# EAGLE design BLT_Preliminary_Avionics_Schematic_Brandon_update_August_8_2021 (EAGLE 9.6.2)
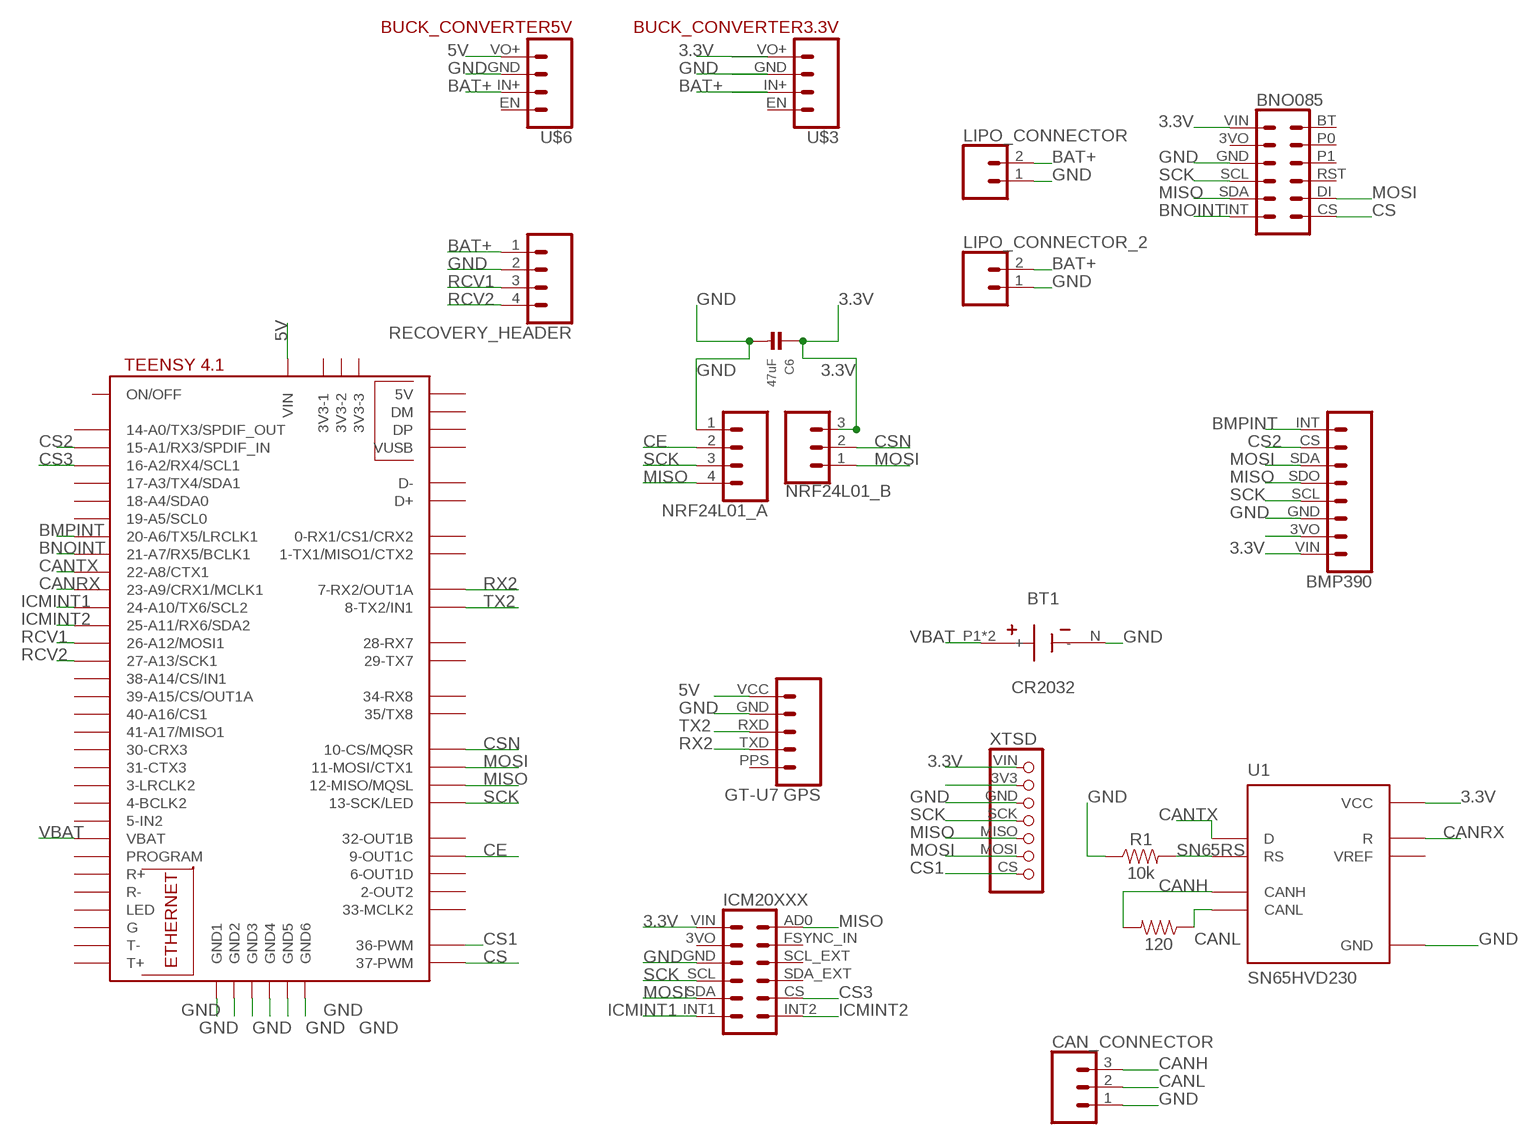
[diagram p0: schematic, sheet 1]

## Parts
120  RESISTOR1206  [1206]
BT1  CR2032  COIN-CELL-THM-3P-3003-CR2032  [BAT_3003]
C6  47uF  CAP_CERAMIC0805  [0805]
CAN_CONNECTOR  CONN_03  [1X03]
LIPO_CONNECTOR  CONN_02PTH4  [1X02_XTRA_BIG]
LIPO_CONNECTOR_2  CONN_02  [1X02]
NRF24L01_A  CONN_04  [1X04]
NRF24L01_B  CONN_03  [1X03]
R1  10k  10KOHM-0603-1/10W-1%  [0603]
RECOVERY_HEADER  CONN_04  [1X04]
U1  SN65HVD230  [SOIC127P599X175-8N]
U$1  TEENSY41  [TEENSY41]
U$2  BMP390  [MICROBUILDER_1X08_ROUND]
U$3  BUCK_CONVERTER3.3V  [1X04]
U$4  GT-U7_GPS  [1X05]
U$5  XTSDXTSD_PINS  [1X07]
U$6  BUCK_CONVERTER5V  [1X04]
U$7  BNO085  [MICROBUILDER_1X06_ROUND_70]
U$8  ICM20XXX  [1X06]

## Nets
3.3V: C6.1 NRF24L01_B.3 U1.3(VCC) U$2.VIN U$3.VO+ U$5.VIN U$7.VIN U$8.VIN(VCC)
5V: U$1.VIN U$4.VCC U$6.VO+
BAT+: LIPO_CONNECTOR.2 LIPO_CONNECTOR_2.2 RECOVERY_HEADER.1 U$3.IN+ U$6.IN+
BMPINT: U$1.20-A6/TX5/LRCLK1 U$2.INT
BNOINT: U$1.21-A7/RX5/BCLK1 U$7.INT
CANH: 120.2 CAN_CONNECTOR.3 U1.7(CANH)
CANL: 120.1 CAN_CONNECTOR.2 U1.6(CANL)
CANRX: U1.4(R) U$1.23-A9/CRX1/MCLK1
CANTX: U1.1(D) U$1.22-A8/CTX1
CE: NRF24L01_A.2 U$1.9-OUT1C
CS: U$1.37-PWM U$7.CS
CS1: U$1.36-PWM U$5.CS
CS2: U$1.15-A1/RX3/SPDIF_IN U$2.CS
CS3: U$1.16-A2/RX4/SCL1 U$8.CS
CSN: NRF24L01_B.2 U$1.10-CS\MQSR(10-CS/MQSR)
GND: BT1.N(-) C6.2 CAN_CONNECTOR.1 LIPO_CONNECTOR.1 LIPO_CONNECTOR_2.1 NRF24L01_A.1 R1.1 RECOVERY_HEADER.2 U1.2(GND) U$1.GND1 U$1.GND2 U$1.GND3 U$1.GND4 U$1.GND5 U$1.GND6 U$2.GND U$3.GND U$4.GND U$5.GND U$6.GND U$7.GND U$8.GND
ICMINT1: U$1.24-A10/TX6/SCL2 U$8.INT1
ICMINT2: U$1.25-A11/RX6/SDA2 U$8.INT2
MISO: NRF24L01_A.4 U$1.12-MISO/MQSL U$2.SDO U$5.MISO U$7.SDA U$8.AD0
MOSI: NRF24L01_B.1 U$1.11-MOSI/CTX1 U$2.SDA U$5.MOSI U$7.DI U$8.SDA
N$9: U$5.3V3
N$13: U$2.3VO
RCV1: RECOVERY_HEADER.3 U$1.26-A12/MOSI1
RCV2: RECOVERY_HEADER.4 U$1.27-A13/SCK1
RX2: U$1.7-RX2/OUT1A U$4.TXD
SCK: NRF24L01_A.3 U$1.13-SCK/LED U$2.SCL U$5.SCK U$7.SCL U$8.SCL
SN65RS: R1.2 U1.8(RS)
TX2: U$1.8-TX2/IN1 U$4.RXD
VBAT: BT1.P1(+) BT1.P2(+) U$1.VBAT
Unconnected: U1.5(VREF) U$1.0-RX1/CS1/CRX2 U$1.1-TX1/MISO1/CTX2 U$1.2-OUT2 U$1.3-LRCLK2 U$1.3V3-1 U$1.3V3-2 U$1.3V3-3 U$1.4-BCLK2 U$1.5-IN2 U$1.6-OUT1D U$1.14-A0/TX3/SPDIF_OUT U$1.17-A3/TX4/SDA1 U$1.18-A4/SDA0 U$1.19-A5/SCL0 U$1.28-RX7 U$1.29-TX7 U$1.30-CRX3 U$1.31-CTX3 U$1.32-OUT1B U$1.33-MCLK2 U$1.34-RX8 U$1.35-TX8(35/TX8) U$1.38-A14/CS/IN1 U$1.39-A15/CS/OUT1A U$1.40-A16/CS1 U$1.41-A17/MISO1 U$1.+5V(5V) U$1.D+ U$1.D- U$1.DM U$1.DP U$1.G U$1.LED U$1.ON/OFF U$1.PROGRAM U$1.R+ U$1.R- U$1.T+ U$1.T- U$1.VUSB U$3.EN U$4.PPS U$6.EN U$7.3VO U$7.BT U$7.P0 U$7.P1 U$7.RST U$8.3VO U$8.FSYNC_IN U$8.SCL_EXT U$8.SDA_EXT

## Library data of the parts
120 = SparkFun-Resistors:RESISTOR: Generic Resistor Package
BT1 = Battery_Holder:COIN-CELL-THM-3P?-: Battery Holders - Coin Cell THT - CR2032, LR44, SR44 etc. Datasheet <https://docs.rs-online.com/b397/0900766b813ec0e2.pdf>; CATEGORY: Battery-Holder; CELL_DIAMETER: 20mm; DESCRIPTION: Battery Retainer Coin, 20.0mm 1 Cell PC Pin; MANUFACTURER: Keystone Electronics; MPN: 3003; PART_STATUS: ACTIVE; ROHS_COMPLIANT: COMPLIANT; SERIES: -; SUB_CATEGORY: Holder; TYPE: Coin Cell
C6 = microbuilder:CAP_CERAMIC: Ceramic Capacitors 0402 - 0402 Surface Mount Capacitors 16pF 50V 5% [Digikey: 445-4899-2-ND] 18pF 50V 5% [Digikey: 490-1281-2-ND] 22pF 50V 5% [Digikey: 490-1283-2-ND] 68pF 50V 5% [Digikey: 490-1289-2-ND] 0.1uF 10V 10% [Digikey: 490-1318-2-ND] 1.0uF 6.3V 10% [Digikey: 490-1320-2-ND] 0603 - 0603 Surface Mount Capacitors 16 pF 50V 5% [Digikey: 445-5051-2-ND] 22 pF 50V [Digikey: PCC220ACVTR-ND] 33 pF 50V 5% [Digikey: 490-1415-1-ND] 56pF 50V 5% [Digikey: 490-1421-1-ND] 220pF 50V 5% [Digikey: 445-1285-1-ND] 680 pF 50V 2200 pF 50V 5% C0G [Digikey: 445-1297-1-ND] 5600 pF 100V 5% X7R [Digikey: 478-3711-1-ND] 0.1 µF 25V 10% [Digikey: PCC2277TR-ND] 0.22 µF 16V 10% X7R [Digikey: 445-1318-1-ND] 1.0 µF 25V 10% [Digikey: 445-5146-2-ND] 0603 - RF Specific 3pF 250V +/-0.1pF RF [Digikey: 712-1347-1-ND] 18 pF 250V 5% [Digikey: 478-3505-1-ND or 712-1322-1-ND] 56 pF 250V 5% C0G RF [Digikey: 490-4867-1-ND] 68 pF 250V RF [Digikey: 490-4868-1-ND] 0805 - 0805 Surface Mount Capacitors 220 pF 250V 2% RF Ceramic Capacitor [Digikey: 712-1398-1-ND] 1000 pF 50V 2% NP0 Ceramic Capacitor [Digikey: 478-3760-1-ND] 0.1 µF 25V 10% Ceramic Capacitor [Digikey: PCC1828TR-ND] 1.0 µF 16V 10% Ceramic Capacitor[Digikey: 490-1691-2-ND] 10.0 µF 10V 10% Ceramic Capacitor[Digikey: 709-1228-1-ND] 10.0 uF 16V 10% Ceramic Capacitor [Digikey: 478-5165-2-ND] 47 uF 6.3V 20% Ceramic Capacitor [Digikey: 587-1779-1-ND or 399-5506-1-ND] 1206 - 1206 Surface Mount Capacitors 47uF 10V 20% Ceramic Capacitor [Digikey: 490-5528-1-ND or 399-5508-1-ND or 445-6010-1-ND] 100uF 6.3V -20%, +80% Y5V Ceramic Capacitor (Digikey: 490-4512-1-ND, Mouser: 81-GRM31CF50J107ZE1L)
CAN_CONNECTOR NRF24L01_B = SparkFun-Connectors:CONN_03: Multi connection point. Often used as Generic Header-pin footprint for 0.1 inch spaced/style header connections On any of the 0.1 inch spaced packages, you can populate with these: Break Away Headers - Straight <https://www.sparkfun.com/products/116> (PRT-00116) Break Away Male Headers - Right Angle <https://www.sparkfun.com/products/553> (PRT-00553) Female Headers <https://www.sparkfun.com/products/115> (PRT-00115) Break Away Headers - Machine Pin <https://www.sparkfun.com/products/117> (PRT-00117) Break Away Female Headers - Swiss Machine Pin <https://www.sparkfun.com/products/743> (PRT-00743) Stackable Header - 3 Pin (Female, 0.1") <https://www.sparkfun.com/products/13875> (PRT-13875) For SCREWTERMINALS and SPRING TERMINALS visit here: Screw Terimnals on SparkFun.com <https://www.sparkfun.com/search/results?term=Screw+Terminals> (5mm/3.5mm/2.54mm spacing) This device is also useful as a general connection point to wire up your design to another part of your project. Our various solder wires solder well into these plated through hole pads. Hook-Up Wire - Assortment (Stranded, 22 AWG) <https://www.sparkfun.com/products/11375> (PRT-11375) Hook-Up Wire - Assortment (Solid Core, 22 AWG) <https://www.sparkfun.com/products/11367> (PRT-11367) View the entire wire category on our website here <https://www.sparkfun.com/categories/141> Special notes: Molex polarized connector foot print use with SKU : PRT-08232 with associated crimp pins and housings.
LIPO_CONNECTOR LIPO_CONNECTOR_2 = SparkFun-Connectors:CONN_02: Multi connection point. Often used as Generic Header-pin footprint for 0.1 inch spaced/style header connections On any of the 0.1 inch spaced packages, you can populate with these: Break Away Headers - Straight <https://www.sparkfun.com/products/116> (PRT-00116) Break Away Male Headers - Right Angle <https://www.sparkfun.com/products/553> (PRT-00553) Female Headers <https://www.sparkfun.com/products/115> (PRT-00115) Break Away Headers - Machine Pin <https://www.sparkfun.com/products/117> (PRT-00117) Break Away Female Headers - Swiss Machine Pin <https://www.sparkfun.com/products/743> (PRT-00743) For SCREWTERMINALS and SPRING TERMINALS visit here: Screw Terimnals on SparkFun.com <https://www.sparkfun.com/search/results?term=Screw+Terminals> (5mm/3.5mm/2.54mm spacing) This device is also useful as a general connection point to wire up your design to another part of your project. Our various solder wires solder well into these plated through hole pads. Hook-Up Wire - Assortment (Stranded, 22 AWG) <https://www.sparkfun.com/products/11375> (PRT-11375) Hook-Up Wire - Assortment (Solid Core, 22 AWG) <https://www.sparkfun.com/products/11367> (PRT-11367) View the entire wire category on our website here <https://www.sparkfun.com/categories/141> Special notes: Molex polarized connector foot print use with: PRT-08233 with associated crimp pins and housings. 2.54_SCREWTERM for use with PRT-10571. 3.5mm Screw Terminal footprints for PRT-08084 5mm Screw Terminal footprints for use with PRT-08432
NRF24L01_A RECOVERY_HEADER = SparkFun-Connectors:CONN_04: Multi connection point. Often used as Generic Header-pin footprint for 0.1 inch spaced/style header connections On any of the 0.1 inch spaced packages, you can populate with these: Break Away Headers - Straight <https://www.sparkfun.com/products/116> (PRT-00116) Break Away Male Headers - Right Angle <https://www.sparkfun.com/products/553> (PRT-00553) Female Headers <https://www.sparkfun.com/products/115> (PRT-00115) Break Away Headers - Machine Pin <https://www.sparkfun.com/products/117> (PRT-00117) Break Away Female Headers - Swiss Machine Pin <https://www.sparkfun.com/products/743> (PRT-00743) For SCREWTERMINALS and SPRING TERMINALS visit here: Screw Terimnals on SparkFun.com <https://www.sparkfun.com/search/results?term=Screw+Terminals> (5mm/3.5mm/2.54mm spacing) This device is also useful as a general connection point to wire up your design to another part of your project. Our various solder wires solder well into these plated through hole pads. Hook-Up Wire - Assortment (Stranded, 22 AWG) <https://www.sparkfun.com/products/11375> (PRT-11375) Hook-Up Wire - Assortment (Solid Core, 22 AWG) <https://www.sparkfun.com/products/11367> (PRT-11367) View the entire wire category on our website here <https://www.sparkfun.com/categories/141> Special notes: Molex polarized connector foot print use with SKU : PRT-08231 with associated crimp pins and housings. 1MM SMD Version SKU: PRT-10208; PROD_ID: CONN-09696
R1 = SparkFun-Resistors:10KOHM: 10kΩ resistor A resistor is a passive two-terminal electrical component that implements electrical resistance as a circuit element. Resistors act to reduce current flow, and, at the same time, act to lower voltage levels within circuits. - Wikipedia; PROD_ID: RES-00824
U1 = SN65HVD230:SN65HVD230: the sn65hvd230 sn65hvd231 and sn65hvd232 controller area network (can) transceivers are designed for use with the tex... Check prices <https://pricing.snapeda.com/parts/SN65HVD230/Texas%20Instruments/view-part?ref=eda>; AVAILABILITY: In Stock; DESCRIPTION: 1/1 Transceiver Half CANbus 8-SOIC; MF: Texas Instruments; MP: SN65HVD230; PACKAGE: SOIC-8 Texas Instruments; PRICE: None; PURCHASE-URL: https://pricing.snapeda.com/search/part/SN65HVD230/?ref=eda
U$1 = teensy:TEENSY41
U$2 = BLTFootprints:BMP390
U$3 = BLTFootprints:BUCK_CONVERTER; VOLTAGE: 3.3V
U$4 = BLTFootprints:GT-U7_GPS
U$5 = BLTFootprints:XTSD
U$6 = BLTFootprints:BUCK_CONVERTER; VOLTAGE: 5V
U$7 = BLTFootprints:BNO085
U$8 = BLTFootprints:ICM20XXX

## Board
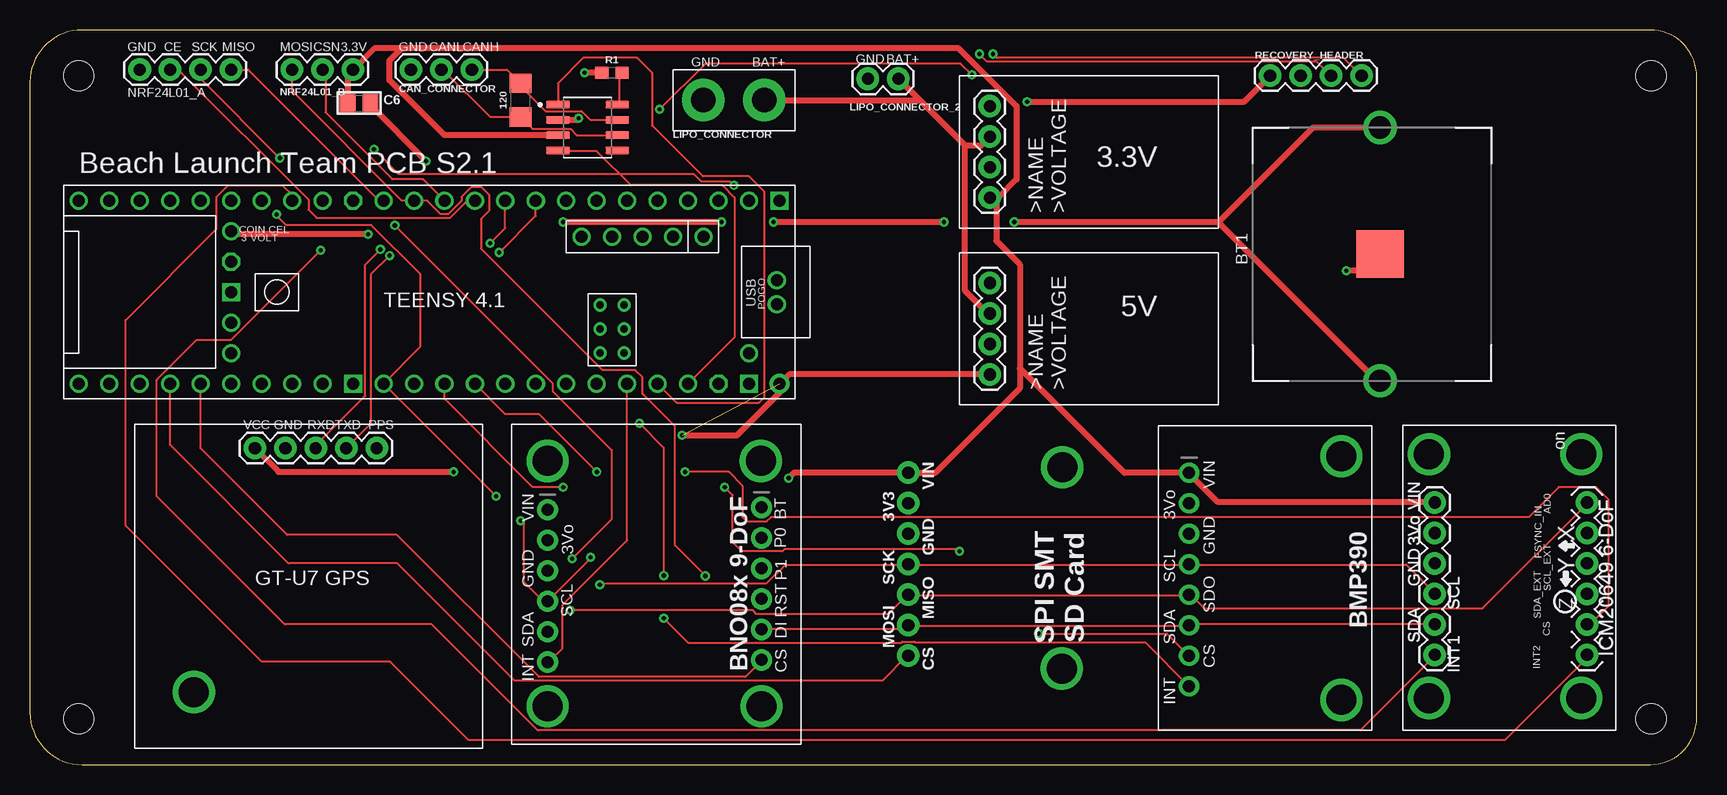
[diagram p1: board, top side]
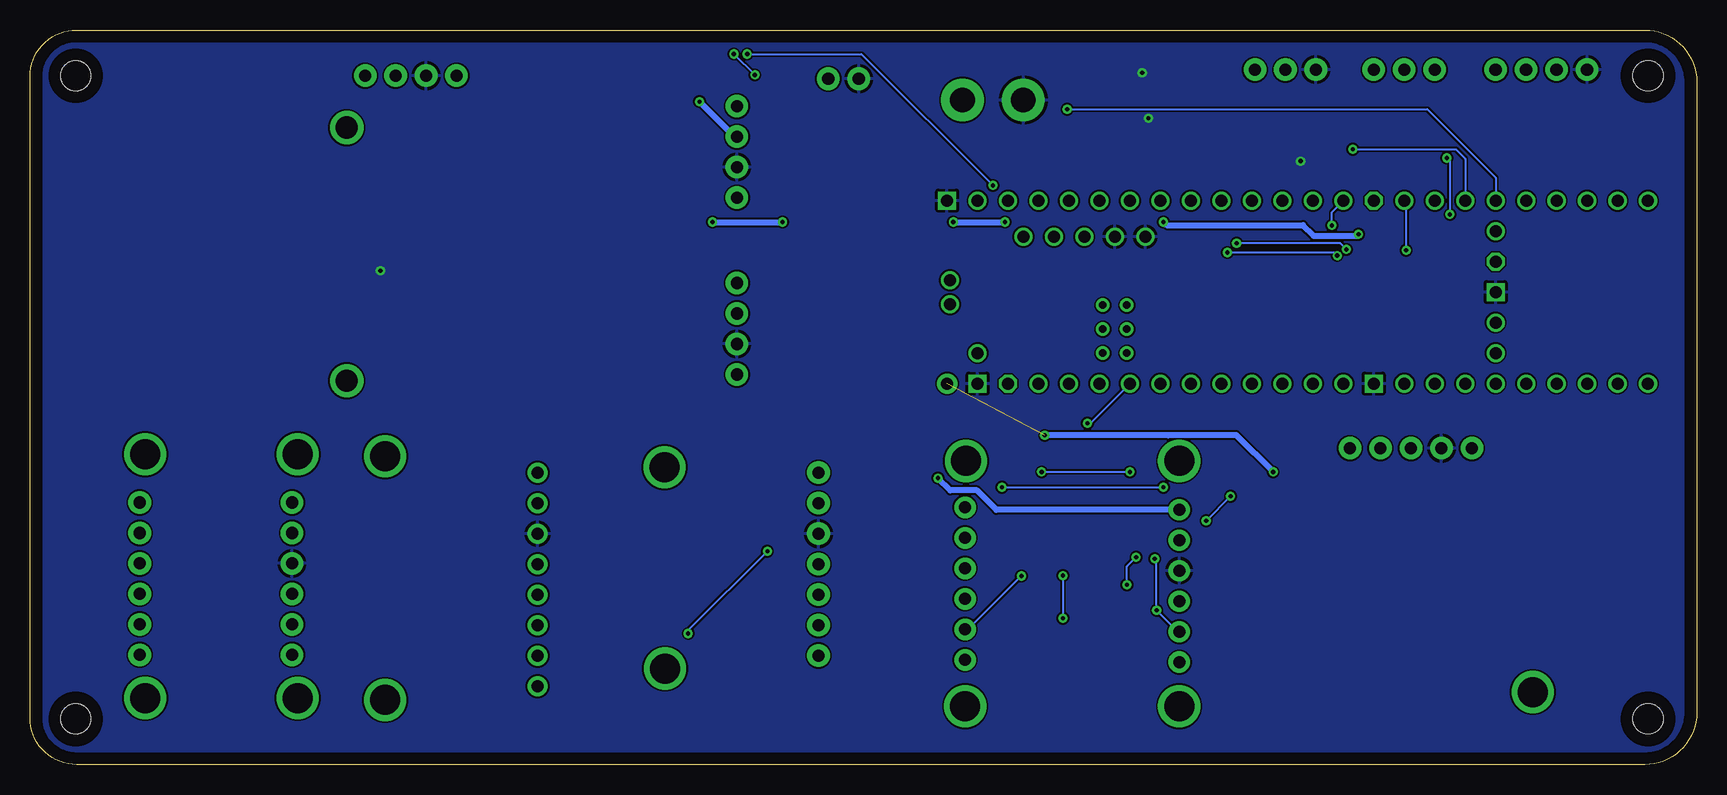
[diagram p2: board, bottom side, seen from below]

Size 138.94 x 61.21 mm. Coordinates in mm from the lower left corner, seen from the top.
Outline: 0,56.88 0,4.34 arc90 4.34,0 135.05,0 arc90 138.94,3.89 138.94,57.32 arc90 135.05,61.21 4.34,61.21 arc90 0,56.88
Copper layers (1*16): Top 0.035mm / dielectric 1.5mm / Bottom 0.035mm
Design rules "default": minimum track width 6mil, minimum drill 0.35mm, track to track 6mil, track to pad 6mil, pad to pad 6mil, via to via 6mil, smd to smd 6mil, copper to edge 40mil, drill to drill 6mil, minimum pad ring 10mil, minimum via ring 8mil, stop-mask expansion 4mil, vias tented up to drill 0mil, thermal gap 10mil
Holes 2.5 mm at 4.06,57.4 4.06,3.81 135.13,57.4 135.13,3.81

### Footprints (pad centres in the part's own frame; a part is rotated, then mirrored left to right if it is on the bottom)
1206 = smd 1.6 x 1.8: 1 -1.4,0; 2 1.4,0
BAT_3003 = smd 3.96 x 3.96: N 10.53,-0.01 | drill 1.85: P1 -0.02,-0.01; P2 21.08,-0.01
0805 = smd 1.3 x 1.5: 1 -0.95,0; 2 0.95,0
1X03 = drill 1.016 pad 1.88: 1 0,0; 2 2.54,0; 3 5.08,0
1X02_XTRA_BIG = drill 2.057 pad 3.556: 1 -2.54,0; 2 2.54,0
1X02 = drill 1.016 pad 1.88: 1 0,0; 2 2.54,0
1X04 = drill 1.016 pad 1.88: 1 0,0; 2 2.54,0; 3 5.08,0; 4 7.62,0
0603 = smd 1.1 x 1: 1 -0.85,0; 2 0.85,0
SOIC127P599X175-8N = smd 1.97 x 0.6: 1 -2.47,1.905; 2 -2.47,0.635; 3 -2.47,-0.635; 4 -2.47,-1.905; 5 2.47,-1.905; 6 2.47,-0.635; 7 2.47,0.635; 8 2.47,1.905
TEENSY41 = drill 1: 0-RX1/CS1/CRX2 -27.94,-7.62; 1-TX1/MISO1/CTX2 -25.4,-7.62; 2-OUT2 -22.86,-7.62; 3-LRCLK2 -20.32,-7.62; 4-BCLK2 -17.78,-7.62; 5-IN2 -15.24,-7.62; 6-OUT1D -12.7,-7.62; 7-RX2/OUT1A -10.16,-7.62; 8-TX2/IN1 -7.62,-7.62; 9-OUT1C -5.08,-7.62; 10-CS\MQSR -2.54,-7.62; 11-MOSI/CTX1 0,-7.62; 12-MISO/MQSL 2.54,-7.62; 13-SCK/LED 2.54,7.62; 14-A0/TX3/SPDIF_OUT 0,7.62; 15-A1/RX3/SPDIF_IN -2.54,7.62; 16-A2/RX4/SCL1 -5.08,7.62; 17-A3/TX4/SDA1 -7.62,7.62; 18-A4/SDA0 -10.16,7.62; 19-A5/SCL0 -12.7,7.62; 20-A6/TX5/LRCLK1 -15.24,7.62; 21-A7/RX5/BCLK1 -17.78,7.62; 22-A8/CTX1 -20.32,7.62; 23-A9/CRX1/MCLK1 -22.86,7.62; 24-A10/TX6/SCL2 7.62,-7.62; 25-A11/RX6/SDA2 10.16,-7.62; 26-A12/MOSI1 12.7,-7.62; 27-A13/SCK1 15.24,-7.62; 28-RX7 17.78,-7.62; 29-TX7 20.32,-7.62; 30-CRX3 22.86,-7.62; 31-CTX3 25.4,-7.62; 32-OUT1B 27.94,-7.62; 33-MCLK2 27.94,7.62; 34-RX8 25.4,7.62; 35-TX8 22.86,7.62; 36-PWM 20.32,7.62; 37-PWM 17.78,7.62; 38-A14/CS/IN1 15.24,7.62; 39-A15/CS/OUT1A 12.7,7.62; 40-A16/CS1 10.16,7.62; 41-A17/MISO1 7.62,7.62; +5V -24.13,-4.62; D+ -30.25,-1; D- -30.25,1; DM -21.59,-4.62; DP -19.05,-4.62; GND4 -16.51,-4.62; GND5 -13.97,-4.62; ON/OFF 15.24,5.08; PROGRAM 15.24,2.54; VBAT 15.24,-5.08; VUSB -27.94,5.08 | drill 1 octagon: 3V3-1 5.08,-7.62; 3V3-2 15.24,-2.54; 3V3-3 -25.4,7.62 | drill 0.6: G -15.51,3.08; LED -17.51,3.08; R+ -17.51,5.08; R- -15.51,5.08; T+ -15.51,1.08; T- -17.51,1.08 | drill 1 square: GND1 -30.48,-7.62; GND2 15.24,0; GND3 5.08,7.62; GND6 -27.94,7.62 | drill 1 pad 1.676: VIN -30.48,7.62
MICROBUILDER_1X08_ROUND = drill 1 pad 1.676: 3VO -6.223,0; CS 6.477,0; GND -3.683,0; INT 9.017,0; SCL -1.143,0; SDA 3.937,0; SDO 1.397,0; VIN -8.763,0 | drill 2.5 pad 3.2: P$1 -10.16,12.7; P$2 10.16,12.7
1X04' = drill 1.016 pad 1.88: EN 7.62,0; GND 2.54,0; IN+ 5.08,0; VO+ 0,0
1X05 = drill 1.016 pad 1.88: GND 2.54,0; PPS 10.16,0; RXD 5.08,0; TXD 7.62,0; VCC 0,0 | drill 2.5 pad 3.2: P$1 -5.08,-20.32
1X07 = drill 1.016 pad 1.88: 3V3 4.128,0.794; CS 16.828,0.794; GND 6.668,0.794; MISO 11.748,0.794; MOSI 14.287,0.794; SCK 9.207,0.794; VIN 1.587,0.794 | drill 2.5 pad 3.2: P$1 1.124,13.626; P$4 17.907,13.589
MICROBUILDER_1X06_ROUND_70 = drill 1 pad 1.778: 3VO 9.652,-5.905; BT 6.921,11.938; CS 19.622,11.938; DI 17.081,11.938; GND 12.192,-5.905; INT 19.812,-5.905; P0 9.461,11.938; P1 12.002,11.938; RST 14.541,11.938; SCL 14.732,-5.905; SDA 17.272,-5.905; VIN 7.112,-5.905 | drill 2.5 pad 3.2: P$1 23.495,11.938; P$2 3.048,11.874; P$3 3.048,-5.905; P$4 23.495,-5.905
1X06 = drill 1.016 pad 1.88: 3VO 2.54,0; AD0 0,12.7; CS 10.16,12.7; FSYNC_IN 2.54,12.7; GND 5.08,0; INT1 12.7,0; INT2 12.7,12.7; SCL 7.62,0; SCL_EXT 5.08,12.7; SDA 10.16,0; SDA_EXT 7.62,12.7; VIN 0,0 | drill 2.5 pad 3.2: P$1 -4.019,12.229; P$2 16.301,12.229; P$3 16.301,-0.471; P$4 -4.019,-0.471

### Placement (x,y rotation side)
120  40.89,55.37 90 top
BT1  112.52,32 90 top
C6  27.43,55.12 0 top
CAN_CONNECTOR  31.75,57.91 0 top
LIPO_CONNECTOR  58.67,55.37 0 top
LIPO_CONNECTOR_2  69.85,57.15 0 top
NRF24L01_A  9.14,57.91 0 top
NRF24L01_B  21.84,57.91 0 top
R1  48.51,57.66 0 top
RECOVERY_HEADER  103.38,57.4 0 top
U1  46.48,53.09 0 top
U$1  32,39.37 180 top
U$2  96.62,15.54 270 top
U$3  BUCK_CONVERTER3.3V  [1X04']  80.01,47.24 90 top
U$4  18.75,26.37 0 top
U$5  72.42,25.91 270 top
U$6  BUCK_CONVERTER5V  [1X04']  80.01,32.51 90 top
U$7  49.05,28.35 270 top
U$8  117.09,21.84 270 top

### Tracks (layer width: path | path; a pad name or v marks a point on that pad's centre or on a via)
3.3V  (via drill 0.35)
  Top 0.152: 117.09,21.88 U$8.VIN
  Top 0.508: 82.52,33.02 82.52,41.69 80.55,43.66 80.55,46.7 U$3.VO+ 80.72,47.24 82.24,48.77 82.24,54.86 77.42,59.69 30.99,59.69 | 82.52,33.02 82.52,31.34 75.49,24.32 U$5.VIN 63.69,24.32 v63.25,23.88 | 30.99,59.69 28.7,59.69 NRF24L01_B.3 26.48,57.47 C6.1 | 117.09,21.88 99.03,21.88 96.62,24.28 U$2.VIN 91.23,24.31 82.52,33.02 | U1.3 34.54,52.45 29.97,57.02 29.97,58.67 30.99,59.69
  Bottom 0.508: U$7.VIN 58.38,21.23 59.99,22.85 62.22,22.85 v63.25,23.88
5V  (via drill 0.35)  (1 unrouted)
  Top 0.508: U$6.VO+ 63.31,32.51 62.55,31.75 62.55,31.05 58.93,27.43 v54.36,27.43 | U$4.VCC 20.73,24.38 v35.31,24.38
  Bottom 0.508: v54.36,27.43 44.07,27.43 44.04,27.46 38.38,27.46 v35.31,24.38
BAT+  (via drill 0.35)
  Top 0.508: 77.95,51.56 77.95,39.46 79.82,37.59 U$6.IN+ | LIPO_CONNECTOR.2 74.17,55.37 | U$3.IN+ 79.25,51.56 77.95,51.56 | 77.95,51.56 77.95,51.59 74.17,55.37 | LIPO_CONNECTOR_2.2 74.17,55.37 | RECOVERY_HEADER.1 101.22,55.24 v83.12,55.24
  Bottom 0.152: 80.1,52.23 U$3.IN+
  Bottom 0.508: 80.1,52.23 v83.12,55.24
BMPINT  (via drill 0.35)
  Top 0.152: v50.8,28.45 52.83,26.42 v52.83,15.75 | v52.83,12.19 54.86,10.16 60.51,10.16 60.52,10.15 72.62,10.15 72.72,10.25 73.69,10.25 73.77,10.17 92.98,10.17 U$2.INT
  Bottom 0.152: U$1.20-A6/TX5/LRCLK1 50.55,28.45 v50.8,28.45 | v52.83,15.75 v52.83,12.19
BNOINT
  Top 0.152: U$1.21-A7/RX5/BCLK1 49.78,18.7 44.39,13.3 44.39,9.68 43.28,8.57 U$7.INT
CANH
  Top 0.152: CAN_CONNECTOR.3 39.75,57.91 120.2 40.89,56.54 42.98,54.45 45.97,54.45 46.71,53.72 U1.7
CANL
  Top 0.152: CAN_CONNECTOR.2 34.42,57.91 38.36,53.97 120.1 41.89,52.98 45.05,52.98 45.58,52.45 U1.6
CANRX
  Top 0.152: U1.4 44.07,51.12 47.24,51.12 50.1,48.26 57.72,48.26 58.74,47.24 58.74,35.62 U$1.23-A9/CRX1/MCLK1
CANTX
  Top 0.152: U1.1 44.01,56.78 46.16,58.93 50.55,58.93 51.84,57.63 51.84,53.27 56.09,49.02 59.94,49.02 61.21,47.75 61.21,30.61 60.77,30.16 53.91,30.16 U$1.22-A8/CTX1
CE
  Top 0.152: U$1.9-OUT1C 36.45,46.99 35.02,45.56 23.88,45.56 23.21,46.23 23.21,47.05 12.35,57.91 NRF24L01_A.2
CS
  Top 0.152: U$1.37-PWM 14.22,26.35 21.43,19.15 30.57,19.15 42.42,7.3 59.63,7.3 60.9,8.57 U$7.CS
CS1
  Top 0.152: U$1.36-PWM 11.68,26.64 21.57,16.75 21.59,16.76 30.61,16.76 40.39,6.98 71.06,6.98 73.12,9.05 U$5.CS
CS2  (via drill 0.35)
  Top 0.152: v57.91,23.11 58.58,22.45 58.58,18.54 59.35,17.77 62.72,17.77 62.89,17.94 77.31,17.94 v77.47,17.78 | U$1.15-A1/RX3/SPDIF_IN 34.54,30.48 41.91,23.11 v44.45,23.11 | v84.07,10.92 94.77,10.92 U$2.CS
  Bottom 0.152: v57.91,23.11 v44.45,23.11 | v77.47,17.78 84.07,11.18 v84.07,10.92
CS3  (via drill 0.35)
  Top 0.152: v54.61,24.38 58.26,24.38 59.39,23.26 59.39,20.62 59.76,20.26 61.4,20.26 61.75,20.61 124.93,20.61 127.43,23.11 130.56,23.11 131.57,22.1 131.57,13.21 130.05,11.68 U$8.CS | v47.24,24.38 42.42,29.21 39.62,29.21 U$1.16-A2/RX4/SCL1
  Bottom 0.152: v54.61,24.38 v47.24,24.38
CSN
  Top 0.152: NRF24L01_B.2 24.64,57.66 24.64,54.36 30.23,48.77 32.77,48.77 U$1.10-CS\MQSR
GND  (via drill 0.35)
  Top 0.508: BT1.N 111.15,41.15 v109.73,41.15 | R1.1 v46.23,57.66 | v45.72,53.85 45.59,53.72 U1.2 | C6.2 28.38,54.93 v33.02,50.29
  pour Bottom: 138.68,5.32 138.68,56.71 arc90 134.65,60.75 5.21,61.05 arc90 0.51,56.36 0.51,4.55 arc90 4.81,0.25 133.62,0.25 arc90
ICMINT1  (via drill 0.35)
  Top 0.152: v24.22,42.86 16.76,35.4 13.91,35.4 10.57,32.07 10.57,22.35 21.24,11.68 33.5,11.68 42.32,2.86 110.9,2.86 117.09,9.05 U$8.INT1
  Bottom 0.152: U$1.24-A10/TX6/SCL2 24.22,46.83 v24.22,42.86
ICMINT2
  Top 0.152: U$1.25-A11/RX6/SDA2 21.84,47.47 21.08,48.23 16.48,48.23 15.53,47.28 15.53,44.6 7.97,37.04 7.97,19.91 19.3,8.57 30.04,8.57 36.58,2.03 122.94,2.03 129.79,8.89 U$8.INT2
MISO  (via drill 0.35)
  Top 0.152: U$1.12-MISO/MQSL 29.11,46.99 18.19,57.91 NRF24L01_A.4 | v45.02,12.86 60.26,12.86 60.58,12.54 71.53,12.54 73.12,14.13 U$5.MISO 73.28,14.13 96.61,14.13 U$2.SDO 96.77,14.13 97.88,13.02 121.06,13.02 129.79,21.75 U$8.AD0 | v30.42,44.93 43.59,31.75 43.59,31.08 48.48,26.19 48.48,20.45 v45.18,17.15
  Bottom 0.152: U$7.SDA 43.28,11.11 v45.02,12.86 45.02,16.99 v45.18,17.15 | U$1.12-MISO/MQSL 30.42,46.04 v30.42,44.93
MOSI  (via drill 0.35)
  Top 0.152: U$7.DI 61.05,11.27 72.8,11.27 73.12,11.59 U$5.MOSI 73.28,11.59 96.61,11.59 U$2.SDA 96.77,11.75 117.09,11.75 U$8.SDA | v56.29,15.72 53.75,18.26 53.75,28.19 51.05,30.89 51.05,32.26 50.45,32.86 47.72,32.86 37.59,42.99 37.59,45.47 38.26,46.13 38.26,47.5 37.66,48.1 36.77,48.1 35.97,47.31 35.97,46.99 34.86,45.88 34.23,45.88 33.12,46.99 U$1.11-MOSI/CTX1 30.99,46.99 21.84,56.13 NRF24L01_B.1
  Bottom 0.152: v56.29,15.72 60.9,11.11 U$7.DI
RCV1  (via drill 0.35)
  Top 0.152: v28.67,51.28 30.73,49.21 55.34,49.21 55.98,48.58 58.36,48.58 v58.67,48.26 | v79.15,59.21 79.79,58.58 107.25,58.58 108.36,57.47 RECOVERY_HEADER.3
  Bottom 0.152: U$1.26-A12/MOSI1 19.3,50.48 20.1,51.28 v28.67,51.28 | v58.67,48.26 69.63,59.21 v79.15,59.21
RCV2  (via drill 0.35)
  Top 0.152: v52.48,54.61 56.29,58.42 77.56,58.42 v78.52,57.47 | v80.26,59.21 80.58,58.9 109.47,58.9 110.9,57.47 RECOVERY_HEADER.4
  Bottom 0.152: U$1.27-A13/SCK1 16.76,48.9 22.48,54.61 v52.48,54.61 | v80.26,59.21 v78.52,57.47
RX2  (via drill 0.35)
  Top 0.152: v29.97,42.42 28.4,40.84 28.4,28.4 U$4.TXD | v39.12,42.67 42.16,45.72 U$1.7-RX2/OUT1A
  Bottom 0.152: v29.97,42.42 30.23,42.67 v39.12,42.67
SCK  (via drill 0.35)
  Top 0.152: v20.57,45.85 20.57,45.72 21.34,44.96 28.45,44.96 32.51,40.89 32.51,34.8 U$1.13-SCK/LED v38.86,22.35 | 41.15,15.24 42.77,13.61 U$7.SCL 46.77,17.24 | v47.5,14.99 47.59,15.08 61.37,15.08 62.96,16.67 73.12,16.67 U$5.SCK 73.28,16.67 96.61,16.67 U$2.SCL 96.77,16.67 114.71,16.67 117.09,14.29 U$8.SCL | v20.83,50.55 14.22,57.15 NRF24L01_A.3
  Top 0.178: 41.15,20.07 41.15,15.24
  Top 0.254: v40.89,20.32 41.15,20.07 | 46.77,17.24 v46.74,17.27
  Bottom 0.152: v20.83,50.55 20.57,50.29 v20.57,45.85 | v38.86,22.35 v40.89,20.32 | v47.5,14.99 47.5,16.51 v46.74,17.27
SN65RS
  Top 0.152: R1.2 49.15,57.47 49.15,55.24 U1.8
TX2  (via drill 0.35)
  Top 0.152: U$4.RXD 23.82,26.62 27.94,30.73 27.94,41.66 v29.21,42.93 | v38.35,43.43 39.62,44.7 U$1.8-TX2/IN1
  Bottom 0.152: v29.21,42.93 29.72,43.43 v38.35,43.43
VBAT  (via drill 0.35)
  Top 0.508: BT1.P1 112.28,31.98 99.05,45.21 | v57.66,45.21 v44.45,45.21 | U$1.VBAT 17.02,44.2 v28.19,44.2 | BT1.P2 106.94,53.08 99.07,45.21 99.05,45.21 | v76.2,45.21 v61.98,45.21 | 99.05,45.21 v82.04,45.21
  Bottom 0.508: v28.19,44.2 28.32,44.07 31.94,44.07 32.83,44.96 44.2,44.96 v44.45,45.21 | v61.98,45.21 v57.66,45.21 | v82.04,45.21 v76.2,45.21

### Text on the board
_tsilk: GND | CE | SCK | MISO | MOSI | CSN | 3.3V | GND | CANL | CANH | GND | BAT+ | GND | BAT+ | NRF24L01_A | 3.3V | Beach Launch Team PCB S2.1 | 5V | VCC | GND | RXD | TXD | PPS